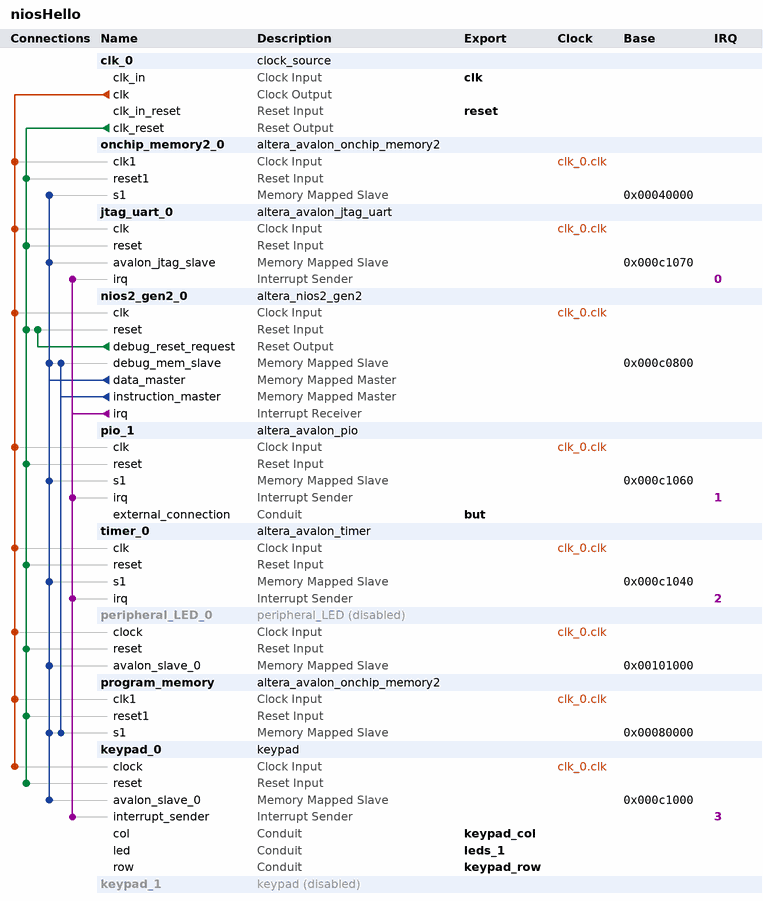
[diagram p0: system contents]
# Platform Designer (Qsys) system niosHello, Cyclone V 5CSEBA6U23I7
# Parameters at their usual value, and those the tool derives, are not listed.
package require -exact qsys 18.0
create_system niosHello
set_project_property DEVICE_FAMILY {Cyclone V}
set_project_property DEVICE 5CSEBA6U23I7

add_instance clk_0 clock_source 18.0
set_instance_parameter_value clk_0 clockFrequency 50000000

add_instance onchip_memory2_0 altera_avalon_onchip_memory2 18.0
set_instance_parameter_value onchip_memory2_0 dataWidth 32
set_instance_parameter_value onchip_memory2_0 dualPort false
set_instance_parameter_value onchip_memory2_0 initMemContent true
set_instance_parameter_value onchip_memory2_0 initializationFileName onchip_mem.hex
set_instance_parameter_value onchip_memory2_0 memorySize 163840

add_instance jtag_uart_0 altera_avalon_jtag_uart 18.0
set_instance_parameter_value jtag_uart_0 simInteractiveOptions NO_INTERACTIVE_WINDOWS

add_instance nios2_gen2_0 altera_nios2_gen2 18.0
set_instance_parameter_value nios2_gen2_0 dcache_size 2048
set_instance_parameter_value nios2_gen2_0 exceptionSlave program_memory.s1
set_instance_parameter_value nios2_gen2_0 icache_size 4096
set_instance_parameter_value nios2_gen2_0 impl Tiny
set_instance_parameter_value nios2_gen2_0 resetSlave program_memory.s1

add_instance pio_1 altera_avalon_pio 18.0
set_instance_parameter_value pio_1 captureEdge true
set_instance_parameter_value pio_1 direction Input
set_instance_parameter_value pio_1 generateIRQ true
set_instance_parameter_value pio_1 irqType EDGE
set_instance_parameter_value pio_1 width 6

add_instance timer_0 altera_avalon_timer 18.0
set_instance_parameter_value timer_0 period 1
set_instance_parameter_value timer_0 periodUnits MSEC

add_instance peripheral_LED_0 peripheral_LED 0.1
set_instance_property peripheral_LED_0 ENABLED false
set_instance_parameter_value peripheral_LED_0 LEN 6

add_instance program_memory altera_avalon_onchip_memory2 18.0
set_instance_parameter_value program_memory dataWidth 32
set_instance_parameter_value program_memory dualPort false
set_instance_parameter_value program_memory initMemContent true
set_instance_parameter_value program_memory initializationFileName onchip_mem.hex
set_instance_parameter_value program_memory memorySize 163840

add_instance keypad_0 keypad 0.1
set_instance_parameter_value keypad_0 LEN_COL 3
set_instance_parameter_value keypad_0 LEN_ROW 4

add_instance keypad_1 keypad 0.1
set_instance_property keypad_1 ENABLED false
set_instance_parameter_value keypad_1 LEN_COL 3
set_instance_parameter_value keypad_1 LEN_ROW 4

# connections
add_connection clk_0.clk jtag_uart_0.clk clock
add_connection clk_0.clk keypad_0.clock clock
add_connection clk_0.clk nios2_gen2_0.clk clock
add_connection clk_0.clk onchip_memory2_0.clk1 clock
add_connection clk_0.clk peripheral_LED_0.clock clock
add_connection clk_0.clk pio_1.clk clock
add_connection clk_0.clk program_memory.clk1 clock
add_connection clk_0.clk timer_0.clk clock
add_connection clk_0.clk_reset jtag_uart_0.reset reset
add_connection clk_0.clk_reset keypad_0.reset reset
add_connection clk_0.clk_reset nios2_gen2_0.reset reset
add_connection clk_0.clk_reset onchip_memory2_0.reset1 reset
add_connection clk_0.clk_reset peripheral_LED_0.reset reset
add_connection clk_0.clk_reset pio_1.reset reset
add_connection clk_0.clk_reset program_memory.reset1 reset
add_connection clk_0.clk_reset timer_0.reset reset
add_connection nios2_gen2_0.debug_reset_request nios2_gen2_0.reset reset
add_connection nios2_gen2_0.data_master jtag_uart_0.avalon_jtag_slave avalon
set_connection_parameter_value nios2_gen2_0.data_master/jtag_uart_0.avalon_jtag_slave baseAddress 0x000c1070
add_connection nios2_gen2_0.data_master keypad_0.avalon_slave_0 avalon
set_connection_parameter_value nios2_gen2_0.data_master/keypad_0.avalon_slave_0 baseAddress 0x000c1000
add_connection nios2_gen2_0.data_master nios2_gen2_0.debug_mem_slave avalon
set_connection_parameter_value nios2_gen2_0.data_master/nios2_gen2_0.debug_mem_slave baseAddress 0x000c0800
add_connection nios2_gen2_0.data_master onchip_memory2_0.s1 avalon
set_connection_parameter_value nios2_gen2_0.data_master/onchip_memory2_0.s1 baseAddress 0x00040000
add_connection nios2_gen2_0.data_master peripheral_LED_0.avalon_slave_0 avalon
set_connection_parameter_value nios2_gen2_0.data_master/peripheral_LED_0.avalon_slave_0 baseAddress 0x00101000
add_connection nios2_gen2_0.data_master pio_1.s1 avalon
set_connection_parameter_value nios2_gen2_0.data_master/pio_1.s1 baseAddress 0x000c1060
add_connection nios2_gen2_0.data_master program_memory.s1 avalon
set_connection_parameter_value nios2_gen2_0.data_master/program_memory.s1 baseAddress 0x00080000
add_connection nios2_gen2_0.data_master timer_0.s1 avalon
set_connection_parameter_value nios2_gen2_0.data_master/timer_0.s1 baseAddress 0x000c1040
add_connection nios2_gen2_0.instruction_master nios2_gen2_0.debug_mem_slave avalon
set_connection_parameter_value nios2_gen2_0.instruction_master/nios2_gen2_0.debug_mem_slave baseAddress 0x000c0800
add_connection nios2_gen2_0.instruction_master program_memory.s1 avalon
set_connection_parameter_value nios2_gen2_0.instruction_master/program_memory.s1 baseAddress 0x00080000
add_connection nios2_gen2_0.irq jtag_uart_0.irq interrupt
set_connection_parameter_value nios2_gen2_0.irq/jtag_uart_0.irq irqNumber 0
add_connection nios2_gen2_0.irq keypad_0.interrupt_sender interrupt
set_connection_parameter_value nios2_gen2_0.irq/keypad_0.interrupt_sender irqNumber 3
add_connection nios2_gen2_0.irq pio_1.irq interrupt
set_connection_parameter_value nios2_gen2_0.irq/pio_1.irq irqNumber 1
add_connection nios2_gen2_0.irq timer_0.irq interrupt
set_connection_parameter_value nios2_gen2_0.irq/timer_0.irq irqNumber 2

# exported interfaces
add_interface but conduit end
set_interface_property but EXPORT_OF pio_1.external_connection
add_interface clk clock sink
set_interface_property clk EXPORT_OF clk_0.clk_in
add_interface keypad_col conduit end
set_interface_property keypad_col EXPORT_OF keypad_0.col
add_interface keypad_row conduit end
set_interface_property keypad_row EXPORT_OF keypad_0.row
add_interface leds_1 conduit end
set_interface_property leds_1 EXPORT_OF keypad_0.led
add_interface reset reset sink
set_interface_property reset EXPORT_OF clk_0.clk_in_reset

set_interconnect_requirement {$system} qsys_mm.clockCrossingAdapter HANDSHAKE
set_interconnect_requirement {$system} qsys_mm.enableEccProtection FALSE
set_interconnect_requirement {$system} qsys_mm.insertDefaultSlave FALSE
set_interconnect_requirement {$system} qsys_mm.maxAdditionalLatency 1

save_system niosHello.qsys
